# Altium schematic sheet openservo.SchDoc
size A4
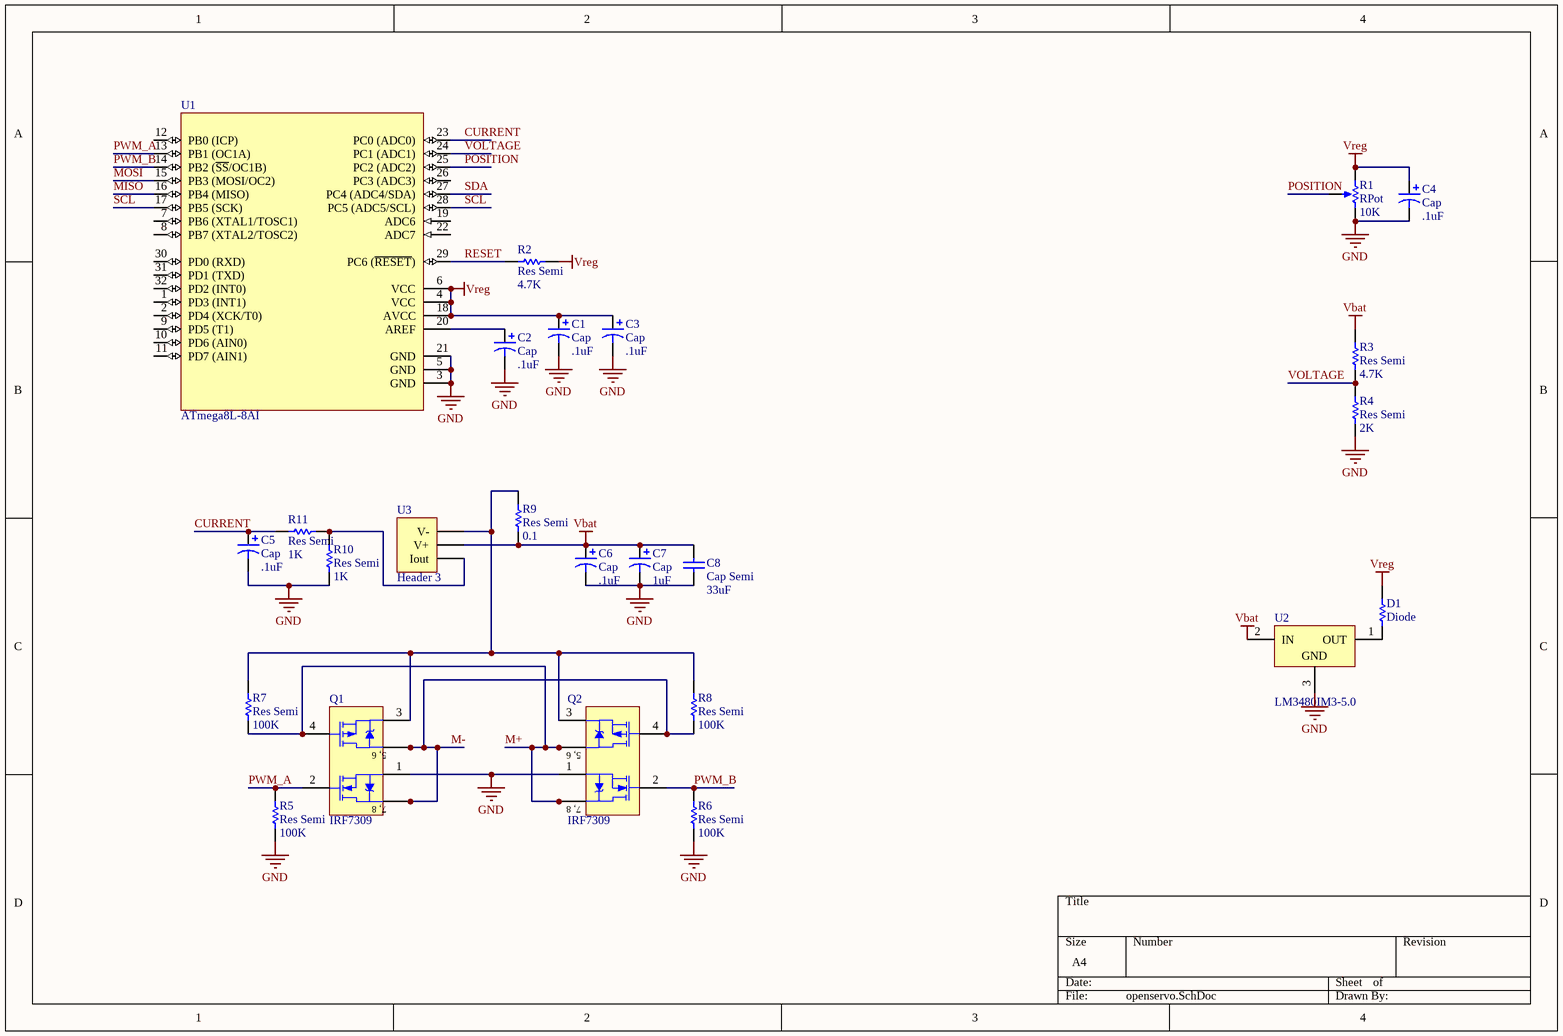
[diagram p0: openservo.SchDoc]

## Parts
C1  Cap  value .1uF  [J1-0603]
C2  Cap  value .1uF  [J1-0603]
C3  Cap  value .1uF  [J1-0603]
C4  Cap  value .1uF  [J1-0603]
C5  Cap  value .1uF  [J1-0603]
C6  Cap  value .1uF  [J1-0603]
C7  Cap  value 1uF  [J1-0603]
C8  Cap Semi  value 33uF  [C1210]
D1  Diode  [2012[0805]]
Q1  IRF7309  [SO-8_N]
Q2  IRF7309  [SO-8_N]
R1  RPot  value 10K  [VR5]
R2  Res Semi  value 4.7K  [1608[0603]]
R3  Res Semi  value 4.7K  [1608[0603]]
R4  Res Semi  value 2K  [1608[0603]]
R5  Res Semi  value 100K  [1608[0603]]
R6  Res Semi  value 100K  [1608[0603]]
R7  Res Semi  value 100K  [1608[0603]]
R8  Res Semi  value 100K  [1608[0603]]
R9  Res Semi  value 0.1  [3216[1206]]
R10  Res Semi  value 1K  [1608[0603]]
R11  Res Semi  value 1K  [1608[0603]]
U1  ATmega8L-8AI  [32A_N]
U2  LM3480IM3-5.0  [MF03A_N]
U3  Header 3  [SOT23_L]

## Nets
GND: C1.2 C2.2 C3.2 C4.2 C5.2 C6.2 C7.2 C8.1 Q1.1(S1) Q2.1(S1) R1.3(BOT) R4.1 R5.1 R6.1 R10.1 U1.3(GND) U1.5(GND) U1.21(GND) U2.3(GND)
Vbat: C6.1 C7.1 C8.2 R3.2 R9.1 U2.2(IN) U3.2(V+)
Vreg: C1.1 C3.1 C4.1 D1.2 R1.1(TOP) R2.2 U1.4(VCC) U1.6(VCC) U1.18(AVCC)
CURRENT: C5.1 R11.2 U1.23(PC0_(ADC0))
M+: Q1.4(G2) Q2.5(D2) Q2.6(D2) Q2.7(D1) Q2.8(D1) R7.1
M-: Q1.5(D2) Q1.6(D2) Q1.7(D1) Q1.8(D1) Q2.4(G2) R8.1
MISO: U1.16(PB4_(MISO))
MOSI: U1.15(PB3_(MOSI/OC2))
POSITION: R1.2(TAP) U1.25(PC2_(ADC2))
PWM_A: Q1.2(G1) R5.2 U1.13(PB1_(OC1A))
PWM_B: Q2.2(G1) R6.2 U1.14(PB2_(~{SS}/OC1B))
RESET: R2.1 U1.29(PC6_(~{RESET}))
SCL: U1.17(PB5_(SCK)) U1.28(PC5_(ADC5/SCL))
SDA: U1.27(PC4_(ADC4/SDA))
VOLTAGE: R3.1 R4.2 U1.24(PC1_(ADC1))
NetC2_1: C2.1 U1.20(AREF)
NetD1_1: D1.1 U2.1(OUT)
NetQ1_3: Q1.3(S2) Q2.3(S2) R7.2 R8.2 R9.2 U3.1(V-)
NetR10_2: R10.2 R11.1 U3.3(Iout)

Not connected (* = marked no-connect by the designer): U1 1(PD3_(INT1)) 2(PD4_(XCK/T0)) 7(PB6_(XTAL1/TOSC1)) 8(PB7_(XTAL2/TOSC2)) 9(PD5_(T1)) 10(PD6_(AIN0)) 11(PD7_(AIN1)) 12(PB0_(ICP)) 19(ADC6) 22(ADC7) 26(PC3_(ADC3)) 30(PD0_(RXD)) 31(PD1_(TXD)) 32(PD2_(INT0))

## Notes on the sheet
- (in symbol IRF7309) 5, 6; 7, 8

## Library data of the parts
C1-C7 = Cap Pol3: Polarized Capacitor (Surface Mount); Published: 8-Jun-2000; LatestRevisionDate: 17-Jul-2002; LatestRevisionNote: Re-released for DXP Platform.; PackageReference: C0805; Publisher: Altium Limited
C8 = Cap Semi: Capacitor (Semiconductor SIM Model); Published: 8-Jun-2000; LatestRevisionDate: 17-Jul-2002; LatestRevisionNote: Re-released for DXP Platform.; PackageReference: C1206; Publisher: Altium Limited
D1 R2-R11 = Res Semi: Semiconductor Resistor; Published: 8-Jun-2000; LatestRevisionDate: 17-Jul-2002; LatestRevisionNote: Re-released for DXP Platform.; PackageReference: AXIAL-0.5; Publisher: Altium Limited
Q1 Q2 = IRF7309: HEXFET Power MOSFET; Published: 8-Jun-2000; LatestRevisionDate: 13-Apr-2006; LatestRevisionNote: IPC-7351 Footprint Added.; DatasheetVersion: PD-9.1243B; PackageVersion: Feb-2001; PackageReference: SO-8; Publisher: Altium Limited; PackageDescription: 8-Pin Plastic Small Outline Integrated Circuit 1.27 mm Pitch; Code_JEDEC: MS-012-AA; Code_IPC: SOIC127P600-8; ComponentLink1Description: Manufacturer Link; ComponentLink1URL: http://www.irf.com/; ComponentLink2Description: Datasheet; ComponentLink2URL: http://www.irf.com/product-info/datasheets/data/IRFN054.pdf
R1 = RPot: Potentiometer; Sim Note: Enter the Resistance value and the set point into parameter fields.; Set Position: 0.5; Published: 8-Jun-2000; LatestRevisionDate: 17-Jul-2002; LatestRevisionNote: Re-released for DXP Platform.; PackageReference: VR5; Publisher: Altium Limited
U1 = ATmega8L-8AI: 8-Bit AVR Microcontroller with 8K Bytes of In-System Programmable Flash Memory; Published: 17-Sep-2003; LatestRevisionDate: 13-Apr-2006; LatestRevisionNote: IPC-7351 Footprint Added.; DatasheetVersion: 2486H-AVR-09/02; PackageVersion: revB, Oct-2001; PackageReference: 32A; Publisher: Altium Limited; PackageDescription: 32-Pin Thin Quad Flat Pack 0.8 mm Pitch; Code_JEDEC: MS-026-ABA; ComponentLink1Description: Manufacturer Link; ComponentLink1URL: http://www.atmel.com; ComponentLink2Description: Datasheet; ComponentLink2URL: http://www.atmel.com/dyn/resources/prod_documents/doc2486.pdf
U2 = LM3480IM3-5.0: 100 mA, SOT-23, Quasi Low-Dropout Linear Voltage Regulator; Manufacturer: National Semiconductor; CompType: LDO IC; PackageTopMarking: L0B*XTT; Published: 4-Dec-2008; DatasheetVersion: Mar-2005; PackageVersion: revB, Mar-2003; PackageReference: MF03A; Publisher: Altium Limited; PackageDescription: Molded SOT-23, .115 x .051 x .037in Body, 3 Lead, .075 in Pitch; PartNumber: LM3480IM3-5.0; RoHS: O; PinCount: 3; DigiKeyPartNumber: LM3480IM3-5.0CT-ND; ComponentLink1Description: LM3480 Datasheet; ComponentLink1URL: http://www.national.com/ds/LM/LM3480.pdf; ComponentLink2Description: LM3480 Web Page; ComponentLink2URL: http://www.national.com/pf/LM/LM3480.html; ComponentLink3Description: MF03A Package Page; ComponentLink3URL: http://www.national.com/packaging/folders/mf03a.html
U3 = Header 3: Header, 3-Pin; LatestRevisionDate: 17-Jul-2002; LatestRevisionNote: Re-released for DXP Platform.; Publisher: Altium Limited